# EAGLE design TS-ARM3.0_6 (EAGLE 7.4.0)
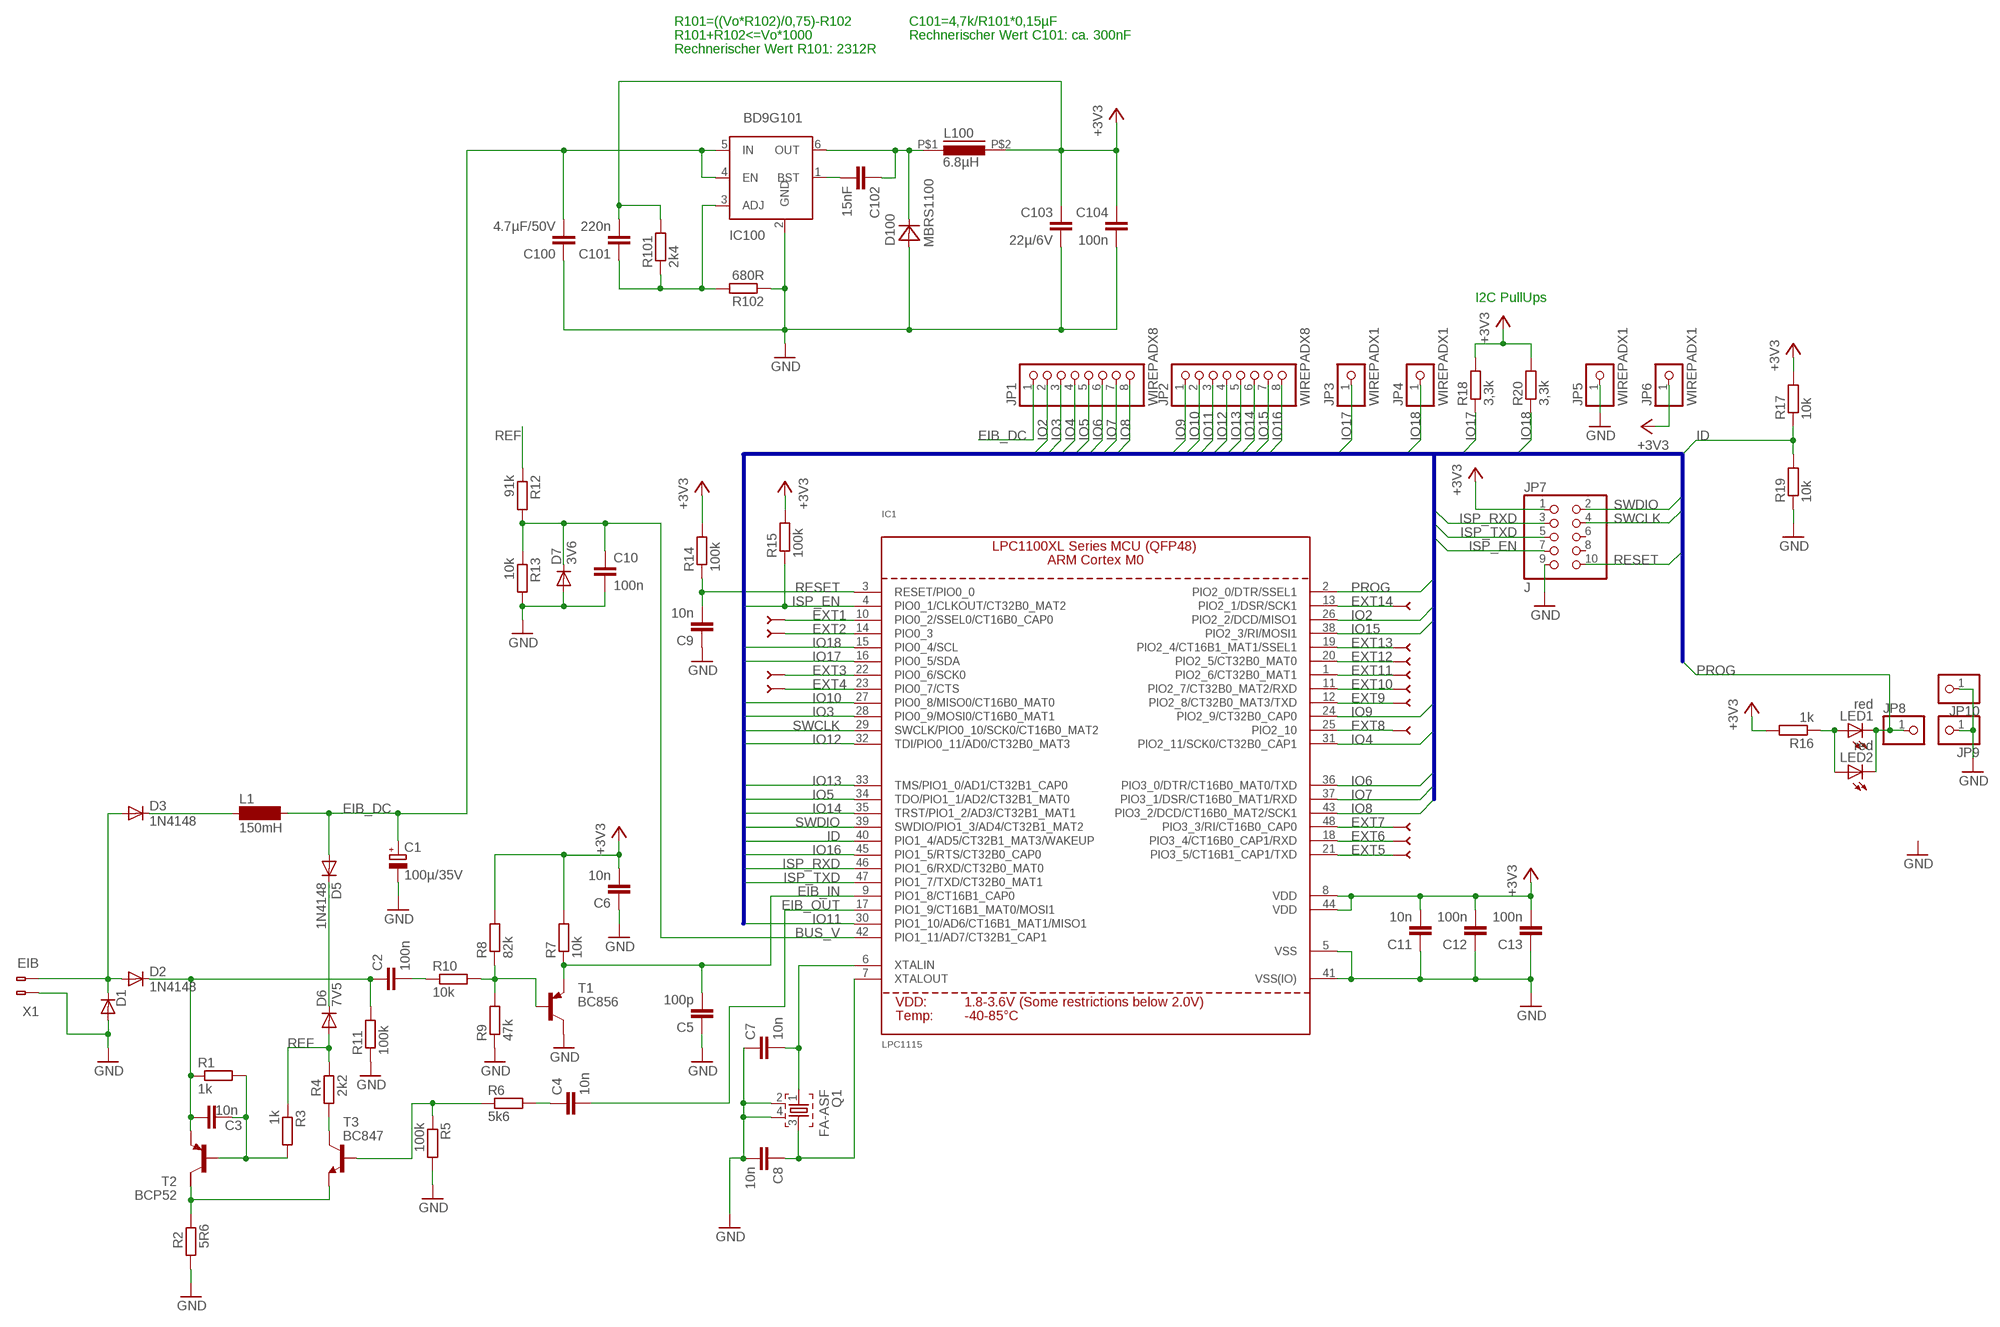
[diagram p0: schematic, sheet 1]

## Parts
C1  100µ/35V  CPOL-EUSANYO_SMD_C6  [SANYO-OSCON_SMD_C6]
C2  100n  C-EUC1206  [C1206]
C3  10n  C-EUC1206  [C1206]
C4  10n  C-EUC1206  [C1206]
C5  100p  C-EUC1206  [C1206]
C6  10n  C-EUC1206  [C1206]
C7  10n  C-EUC1206  [C1206]
C8  10n  C-EUC1206  [C1206]
C9  10n  C-EUC1206  [C1206]
C10  100n  C-EUC1206  [C1206]
C11  10n  C-EUC1206  [C1206]
C12  100n  C-EUC1206  [C1206]
C13  100n  C-EUC1206  [C1206]
C100  4.7µF/50V  C-EUC1206  [C1206]
C101  220n  C-EUC1206  [C1206]
C102  15nF  C-EUC1206  [C1206]
C103  22µ/6V  C-EUC1206  [C1206]
C104  100n  C-EUC1206  [C1206]
D1  SMAJ40C  D-SMB  [SMB]
D2  1N4148  DIODE-MINIMELF  [MINIMELF]
D3  1N4148  DIODE-MINIMELF  [MINIMELF]
D5  1N4148  DIODE-MINIMELF  [MINIMELF]
D6  7V5  DIODE-MINIMELF  [MINIMELF]
D7  3V6  DIODE-MINIMELF  [MINIMELF]
D100  MBRS1100  MBRA340T3  [SMA]
IC1  LPC1115  LPC1113/4/5_QFP48_XLSERIES  [LQFP48]
IC100  BD9G101  BD9G101GBD9G101G-SOT23-6  [SOT23-6]
JP1  WIREPADX8  [SMD1,27X2,54X8]
JP2  WIREPADX8  [SMD1,27X2,54X8]
JP3  WIREPADX1  [SMD1,27X2,54]
JP4  WIREPADX1  [SMD1,27X2,54]
JP5  WIREPADX1  [SMD1,27X2,54]
JP6  WIREPADX1  [SMD1,27X2,54]
JP7  J  PINHD-2X05_2.00  [2X05M]
JP8  PINHD-1X1  [1X01]
JP9  PINHD-1X1  [1X01]
JP10  PINHD-1X1  [1X01]
L1  150mH  SD12-1000  [SD12_1000]
L100  6.8µH  IND_FASTRON_1616FPS  [PIS2812]
LED1  red  LEDCHIPLED_1206  [CHIPLED_1206]
LED2  red  LED3MM  [LED3MM]
P1  PAD  [PAD]
P2  PAD  [PAD]
P3  PAD  [PAD]
P4  PAD  [PAD]
P5  PAD  [PAD]
P6  PAD  [PAD]
P7  PAD  [PAD]
P8  PAD  [PAD]
P9  PAD  [PAD]
P10  PAD  [PAD]
P11  PAD  [PAD]
P12  PAD  [PAD]
P13  PAD  [PAD]
P14  PAD  [PAD]
Q1  FA-ASF  [ASF]
R1  1k  R-EU_R1206  [R1206]
R2  5R6  R-EU_R1206  [R1206]
R3  1k  R-EU_R1206  [R1206]
R4  2k2  R-EU_R1206  [R1206]
R5  100k  R-EU_R1206  [R1206]
R6  5k6  R-EU_R1206  [R1206]
R7  10k  R-EU_R1206  [R1206]
R8  82k  R-EU_R1206  [R1206]
R9  47k  R-EU_R1206  [R1206]
R10  10k  R-EU_R1206  [R1206]
R11  100k  R-EU_R1206  [R1206]
R12  91k  R-EU_R1206  [R1206]
R13  10k  R-EU_R1206  [R1206]
R14  100k  R-EU_R1206  [R1206]
R15  100k  R-EU_R1206  [R1206]
R16  1k  R-EU_R1206  [R1206]
R17  10k  R-EU_R1206  [R1206]
R18  3,3k  R-EU_R1206  [R1206]
R19  10k  R-EU_R1206  [R1206]
R20  3,3k  R-EU_R1206  [R1206]
R101  2k4  R-EU_R1206  [R1206]
R102  680R  R-EU_R1206  [R1206]
T1  BC856  BC856BSMD  [SOT23-BEC]
T2  BCP52  FZT753SMD  [SOT223]
T3  BC847  [SOT23]
X1  EIB  [BUSKLEMME243-724]

## Nets
+3V3: C6.2 C11.2 C12.2 C13.2 C101.2 C103.1 C104.1 IC1.8(VDD) IC1.44(VDD) JP6.1 JP7.1 L100.P$2 R7.2 R8.2 R14.2 R15.2 R16.2 R17.2 R18.2 R20.2 R101.2
BUS_V: C10.2 D7.C IC1.42(PIO1_11/AD7/CT32B1_CAP1) R12.2 R13.1
DRAIN: C2.1 C3.1 D2.C R1.1 R11.2 T2.3(E)
EIB+: D1.1(C) D2.A D3.A X1.2(B-2)
EIB_DC: C1.+ C100.2 D5.A IC100.4(EN) IC100.5(IN) JP1.1 L1.2
EIB_IN: C5.2 IC1.9(PIO1_8/CT16B1_CAP0) R7.1 T1.E
EIB_OUT: C4.2 IC1.17(PIO1_9/CT16B1_MAT0/MOSI1)
EXT1: IC1.10(PIO0_2/SSEL0/CT16B0_CAP0) P1.1
EXT2: IC1.14(PIO0_3) P2.1
EXT3: IC1.22(PIO0_6/SCK0) P13.1
EXT4: IC1.23(PIO0_7/CTS) P14.1
EXT5: IC1.21(PIO3_5/CT16B1_CAP1/TXD) P12.1
EXT6: IC1.18(PIO3_4/CT16B0_CAP1/RXD) P11.1
EXT7: IC1.48(PIO3_3/RI/CT16B0_CAP0) P10.1
EXT8: IC1.25(PIO2_10) P6.1
EXT9: IC1.12(PIO2_8/CT32B0_MAT3/TXD) P4.1
EXT10: IC1.11(PIO2_7/CT32B0_MAT2/RXD) P5.1
EXT11: IC1.1(PIO2_6/CT32B0_MAT1) P9.1
EXT12: IC1.20(PIO2_5/CT32B0_MAT0) P8.1
EXT13: IC1.19(PIO2_4/CT16B1_MAT1/SSEL1) P7.1
EXT14: IC1.13(PIO2_1/DSR/SCK1) P3.1
GND: C1.- C5.1 C6.1 C7.1 C8.2 C9.1 C10.1 C11.1 C12.1 C13.1 C100.1 C103.2 C104.2 D1.2(A) D7.A D100.A IC1.5(VSS) IC1.41(VSS(IO)) IC100.2(GND) JP5.1 JP7.9 JP9.1 JP10.1 Q1.2 Q1.4 R2.1 R5.2 R9.1 R11.1 R13.2 R19.1 R102.1 T1.C X1.1(B-1)
ID: IC1.40(PIO1_4/AD5/CT32B1_MAT3/WAKEUP) R17.1 R19.2
IO2: IC1.26(PIO2_2/DCD/MISO1) JP1.2
IO3: IC1.28(PIO0_9/MOSI0/CT16B0_MAT1) JP1.3
IO4: IC1.31(PIO2_11/SCK0/CT32B0_CAP1) JP1.4
IO5: IC1.34(TDO/PIO1_1/AD2/CT32B1_MAT0) JP1.5
IO6: IC1.36(PIO3_0/DTR/CT16B0_MAT0/TXD) JP1.6
IO7: IC1.37(PIO3_1/DSR/CT16B0_MAT1/RXD) JP1.7
IO8: IC1.43(PIO3_2/DCD/CT16B0_MAT2/SCK1) JP1.8
IO9: IC1.24(PIO2_9/CT32B0_CAP0) JP2.1
IO10: IC1.27(PIO0_8/MISO0/CT16B0_MAT0) JP2.2
IO11: IC1.30(PIO1_10/AD6/CT16B1_MAT1/MISO1) JP2.3
IO12: IC1.32(TDI/PIO0_11/AD0/CT32B0_MAT3) JP2.4
IO13: IC1.33(TMS/PIO1_0/AD1/CT32B1_CAP0) JP2.5
IO14: IC1.35(TRST/PIO1_2/AD3/CT32B1_MAT1) JP2.6
IO15: IC1.38(PIO2_3/RI/MOSI1) JP2.7
IO16: IC1.45(PIO1_5/RTS/CT32B0_CAP0) JP2.8
IO17: IC1.16(PIO0_5/SDA) JP3.1 R18.1
IO18: IC1.15(PIO0_4/SCL) JP4.1 R20.1
ISP_EN: IC1.4(PIO0_1/CLKOUT/CT32B0_MAT2) JP7.7 R15.1
ISP_RXD: IC1.46(PIO1_6/RXD/CT32B0_MAT0) JP7.3
ISP_TXD: IC1.47(PIO1_7/TXD/CT32B0_MAT1) JP7.5
LX: C102.1 D100.C IC100.6(OUT) L100.P$1
N$1: C2.2 R10.1
N$2: C101.1 IC100.3(ADJ) R101.1 R102.2
N$3: C4.1 R6.2
N$4: C7.2 IC1.6(XTALIN) Q1.1
N$5: C8.1 IC1.7(XTALOUT) Q1.3
N$6: R4.1 T3.3(C)
N$7: R2.2 T2.2(C) T3.2(E)
N$8: D3.C L1.1
N$9: D5.C D6.C
N$12: R5.1 R6.1 T3.1(B)
N$14: R8.1 R9.2 R10.2 T1.B
N$15: C3.2 R1.2 R3.2 T2.1(B)
N$19: C102.2 IC100.1(BST)
N$41: LED1.A LED2.A R16.1
PROG: IC1.2(PIO2_0/DTR/SSEL1) JP8.1 LED1.C LED2.K(C)
REF: D6.A R3.1 R4.2 R12.1
RESET: C9.2 IC1.3(RESET/PIO0_0) JP7.10 R14.1
SWCLK: IC1.29(SWCLK/PIO0_10/SCK0/CT16B0_MAT2) JP7.4
SWDIO: IC1.39(SWDIO/PIO1_3/AD4/CT32B1_MAT2) JP7.2
Unconnected: JP7.6 JP7.8 T2.4(C/)

## Buses
IO[1..18],RESET,SWCLK,SWDIO,ISP_EN,PROG,ID,ISP_TXD,ISP_RXD

## Notes on the sheet
- R101=((Vo*R102)/0,75)-R102 | C101=4,7k/R101*0,15µF
- R101+R102<=Vo*1000 | Rechnerischer Wert C101: ca. 300nF
- Rechnerischer Wert R101: 2312R
- I2C PullUps

## Library data of the parts
C1 = rcl:CPOL-EU: POLARIZED CAPACITOR, European symbol; REICHELT: VF 100/35 K-D8
C2 C10 C12 C13 C104 = rcl:C-EU: CAPACITOR, European symbol; REICHELT: X7R-G0805 100N
C3 C4 C6 C9 C11 = rcl:C-EU: CAPACITOR, European symbol; REICHELT: X7R-G0805 10N
C5 = rcl:C-EU: CAPACITOR, European symbol; REICHELT: NPO-G0805 100P
C7 C8 = rcl:C-EU: CAPACITOR, European symbol
C100 = rcl:C-EU: CAPACITOR, European symbol; REICHELT: X7R-G1206 4,7/50
C101 = rcl:C-EU: CAPACITOR, European symbol; REICHELT: Y5R-G0603 220N
C102 = rcl:C-EU: CAPACITOR, European symbol; REICHELT: X7R-G0805 15N
C103 = rcl:C-EU: CAPACITOR, European symbol; REICHELT: X5R-G0805 22/6
D1 = semicon-smd-ipc:D-: DIODE unfilled
D2 D3 D5 = diode:DIODE-: DIODE; REICHELT: 1N 4148 SMD
D6 = diode:DIODE-: DIODE; REICHELT: SMD ZF 7,5
D7 = diode:DIODE-: DIODE; REICHELT: SMD ZF 3,6
D100 = diode:MBRA340T3: Surface Mount Schottky Power Rectifier Source: http://www.onsemi.com/pub_link/Collateral/MBRA340T3-D.PDF; REICHELT: MBRS 1100 SMD
IC1 = microbuilder:LPC1113/4/5_QFP48_XLSERIES: LPC1113/4/5 ARM Cortex M0 MCU (50MHz) - XL Series (FBD48/3x3) LPC1115FBD48/303: Max Frequency: 50MHz Flash: 64kB SRAM: 8kB ADC: 10-bit
IC100 = Stefan_selfbus:BD9G101G
JP1 JP2 = selfbus:WIREPADX8
JP3-JP6 = selfbus:WIREPADX1
JP7 = pinhead-2:PINHD-2X05: PIN HEADER; REICHELT: MPE 150-3-010
JP8-JP10 = pinhead:PINHD-1X1: PIN HEADER
L1 = inductor-neosid:SD12: INDUCTOR nominal inductance; REICHELT: L-11P 150M
L100 = Stefan_selfbus:IND_FASTRON_1616FPS; REICHELT: L-1616FPS 6,8µ
LED1 LED2 = led:LED: LED OSRAM: - CHIPLED LG R971, LG N971, LY N971, LG Q971, LY Q971, LO R971, LY R971 LH N974, LH R974 LS Q976, LO Q976, LY Q976 LO Q996 - Hyper CHIPLED LW Q18S LB Q993, LB Q99A, LB R99A - SideLED LS A670, LO A670, LY A670, LG A670, LP A670 LB A673, LV A673, LT A673, LW A673 LH A674 LY A675 LS A676, LA A676, LO A676, LY A676, LW A676 LS A679, LY A679, LG A679 - Hyper Micro SIDELED® LS Y876, LA Y876, LO Y876, LY Y876 LT Y87S - SmartLED LW L88C, LW L88S LB L89C, LB L89S, LG L890 LS L89K, LO L89K, LY L89K LS L896, LA L896, LO L896, LY L896 - TOPLED LS T670, LO T670, LY T670, LG T670, LP T670 LSG T670, LSP T670, LSY T670, LOP T670, LYG T670 LG T671, LOG T671, LSG T671 LB T673, LV T673, LT T673, LW T673 LH T674 LS T676, LA T676, LO T676, LY T676, LB T676, LH T676, LSB T676, LW T676 LB T67C, LV T67C, LT T67C, LS T67K, LO T67K, LY T67K, LW E67C LS E67B, LA E67B, LO E67B, LY E67B, LB E67C, LV E67C, LT E67C LW T67C LS T679, LY T679, LG T679 LS T770, LO T770, LY T770, LG T770, LP T770 LB T773, LV T773, LT T773, LW T773 LH T774 LS E675, LA E675, LY E675, LS T675 LS T776, LA T776, LO T776, LY T776, LB T776 LHGB T686 LT T68C, LB T68C - Hyper Mini TOPLED® LB M676 - Mini TOPLED Santana® LG M470 LS M47K, LO M47K, LY M47K Source: http://www.osram.convergy.de - LUMILED® LXK2-PW12-R00, LXK2-PW12-S00, LXK2-PW14-U00, LXK2-PW14-V00 LXK2-PM12-R00, LXK2-PM12-S00, LXK2-PM14-U00 LXK2-PE12-Q00, LXK2-PE12-R00, LXK2-PE12-S00, LXK2-PE14-T00, LXK2-PE14-U00 LXK2-PB12-K00, LXK2-PB12-L00, LXK2-PB12-M00, LXK2-PB14-N00, LXK2-PB14-P00, LXK2-PB14-Q00 LXK2-PR12-L00, LXK2-PR12-M00, LXK2-PR14-Q00, LXK2-PR14-R00 LXK2-PD12-Q00, LXK2-PD12-R00, LXK2-PD12-S00 LXK2-PH12-R00, LXK2-PH12-S00 LXK2-PL12-P00, LXK2-PL12-Q00, LXK2-PL12-R00 Source: www.luxeon.com; REICHELT: SMD-LED 0805 RT
P1-P14 = lpc:PAD
Q1 = crystal:FA-: MHz RANGE CRYSTAL UNIT Source: Epson Toyocom
R1 R3 R16 R17 R19 = rcl:R-EU_: RESISTOR, European symbol; REICHELT: SMD-0805 1,00K
R2 = rcl:R-EU_: RESISTOR, European symbol; REICHELT: SMD-0805 5,60
R4 = rcl:R-EU_: RESISTOR, European symbol; REICHELT: SMD-0805 2,20K
R5 R11 R14 R15 = rcl:R-EU_: RESISTOR, European symbol; REICHELT: SMD-0805 100K
R6 = rcl:R-EU_: RESISTOR, European symbol; REICHELT: SMD-0805 5,60K
R7 R10 R13 = rcl:R-EU_: RESISTOR, European symbol; REICHELT: SMD-0805 10,0K
R8 = rcl:R-EU_: RESISTOR, European symbol; REICHELT: SMD-0805 82,0K
R9 = rcl:R-EU_: RESISTOR, European symbol; REICHELT: SMD-0805 47,0K
R12 = rcl:R-EU_: RESISTOR, European symbol; REICHELT: SMD 1/4W 91K
R18 R20 = rcl:R-EU_: RESISTOR, European symbol; REICHELT: SMD-0805 3,30K
R101 = rcl:R-EU_: RESISTOR, European symbol; REICHELT: SMD 1/4W 2,4K
R102 = rcl:R-EU_: RESISTOR, European symbol; REICHELT: SMD-0805 680
T1 = transistor-pnp:BC856*: PNP Transistror; REICHELT: BC 856B SMD
T2 = transistor-pnp:FZT753SMD: PNP Transistor; REICHELT: BCP 52-16 SMD
T3 = transistor:BC847: NPN TRANSISTOR; REICHELT: BC 847C SMD
X1 = con-wago:EIB

## Board
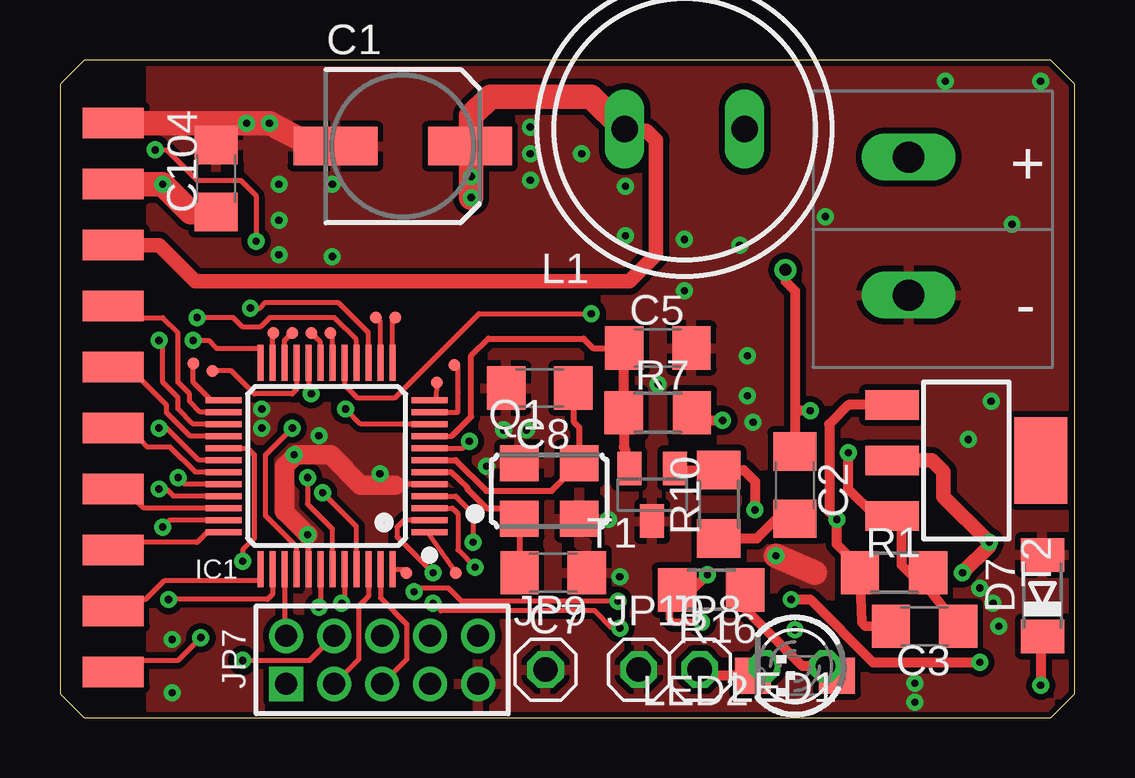
[diagram p1: board, top side]
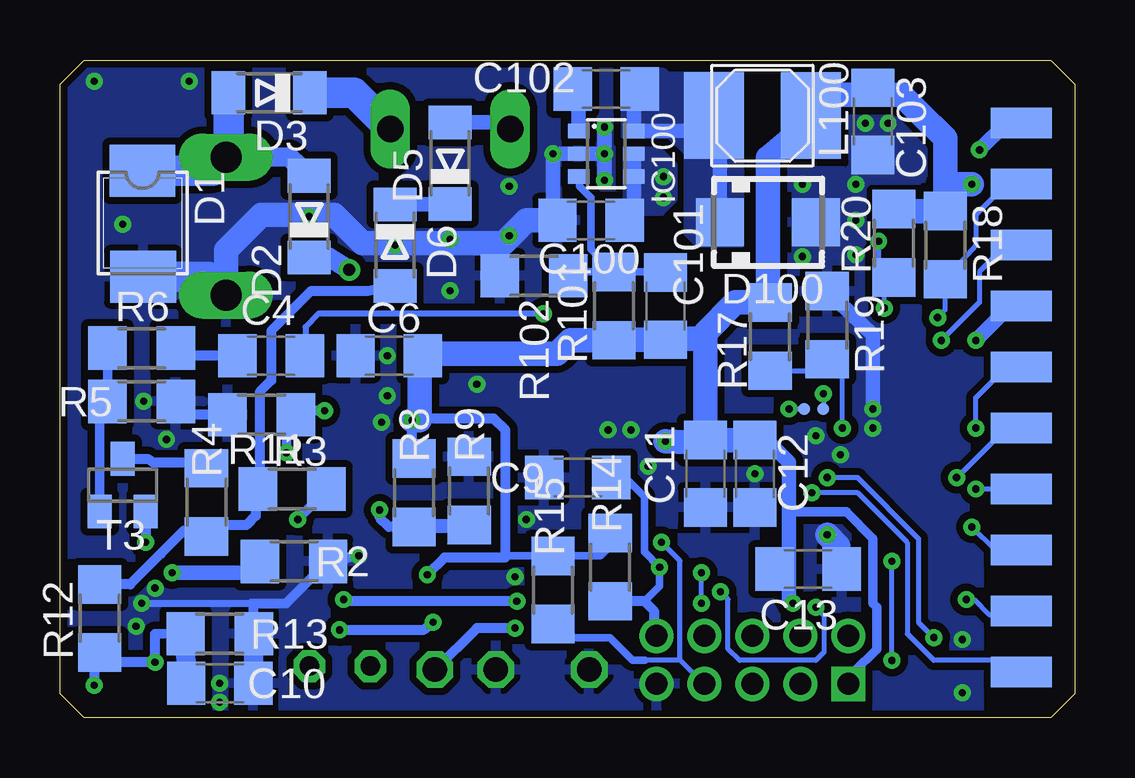
[diagram p2: board, bottom side, seen from below]

Size 42.3 x 27.4 mm. Coordinates in mm from the lower left corner, seen from the top.
Outline: 0,1 1,0 41.3,0 42.3,1 42.3,26.4 41.3,27.4 1,27.4 0,26.4 0,1
Copper layers (1*16): Top 0.035mm / dielectric 1.5mm / Bottom 0.035mm
Design rules "default *": minimum track width 0.2mm, minimum drill 0.3mm, track to track 0.16mm, track to pad 0.16mm, pad to pad 0.16mm, via to via 0.16mm, smd to smd 1mil, copper to edge 0.2mm, drill to drill 8mil, minimum pad ring 10mil, minimum via ring 8mil, stop-mask expansion 4mil, vias tented up to drill 0mil, thermal gap 10mil

### Footprints (pad centres in the part's own frame; a part is rotated, then mirrored left to right if it is on the bottom)
SANYO-OSCON_SMD_C6 = smd 3.5 x 1.6: + 2.8,0; - -2.8,0
C1206 = smd 1.6 x 1.8: 1 -1.4,0; 2 1.4,0
SMB = smd 2.159 x 2.743: 1 -2.311,-0.127; 2 2.108,-0.102
MINIMELF = smd 1.4 x 1.8: A 1.7,0; C -1.7,0
SMA = smd 2 x 2: A 2,0; C -2,0
LQFP48 = smd 1.5 x 0.25: 1 -4.3,2.75; 2 -4.3,2.25; 3 -4.3,1.75; 4 -4.3,1.25; 5 -4.3,0.75; 6 -4.3,0.25; 7 -4.3,-0.25; 8 -4.3,-0.75; 9 -4.3,-1.25; 10 -4.3,-1.75; 11 -4.3,-2.25; 12 -4.3,-2.75; 25 4.3,-2.75; 26 4.3,-2.25; 27 4.3,-1.75; 28 4.3,-1.25; 29 4.3,-0.75; 30 4.3,-0.25; 31 4.3,0.25; 32 4.3,0.75; 33 4.3,1.25; 34 4.3,1.75; 35 4.3,2.25; 36 4.3,2.75 | smd 0.25 x 1.5: 13 -2.75,-4.3; 14 -2.25,-4.3; 15 -1.75,-4.3; 16 -1.25,-4.3; 17 -0.75,-4.3; 18 -0.25,-4.3; 19 0.25,-4.3; 20 0.75,-4.3; 21 1.25,-4.3; 22 1.75,-4.3; 23 2.25,-4.3; 24 2.75,-4.3; 37 2.75,4.3; 38 2.25,4.3; 39 1.75,4.3; 40 1.25,4.3; 41 0.75,4.3; 42 0.25,4.3; 43 -0.25,4.3; 44 -0.75,4.3; 45 -1.25,4.3; 46 -1.75,4.3; 47 -2.25,4.3; 48 -2.75,4.3
SOT23-6 = smd 0.6 x 0.9: 1 -0.95,-1.15; 2 0,-1.15; 3 0.95,-1.15; 4 0.95,1.15; 5 0,1.15; 6 -0.95,1.15
SMD1,27X2,54X8 = smd 2.54 x 1.27: 1 0,8.89; 2 0,6.35; 3 0,3.81; 4 0,1.27; 5 0,-1.27; 6 0,-3.81; 7 0,-6.35; 8 0,-8.89
SMD1,27X2,54 = smd 2.54 x 1.27: 1 0,0
2X05M = drill 0.914 square: 1 -4,-1 | drill 0.914: 2 -4,1; 3 -2,-1; 4 -2,1; 5 0,-1; 6 0,1; 7 2,-1; 8 2,1; 9 4,-1; 10 4,1
1X01 = drill 1.016 octagon: 1 0,0
SD12_1000 = drill 1.1 long: 1 -2.5,0; 2 2.5,0
PIS2812 = smd 3.6 x 2.5: P$1 0,2.025; P$2 0,-2.025
CHIPLED_1206 = smd 1.5 x 1.5: A 0,-1.75; C 0,1.75
LED3MM = drill 0.813 octagon: A -1.27,0; K 1.27,0
PAD = smd 0.5 x 0.5: 1 0,0
ASF = smd 1.6 x 1.5: 1 -1.25,-1.15; 2 1.25,-1.15; 3 1.25,1.15; 4 -1.25,1.15
R1206 = smd 1.6 x 1.803: 1 -1.422,0; 2 1.422,0
SOT23-BEC = smd 1 x 1.4: B -0.95,-1.1; C 0,1.1; E 0.95,-1.1
SOT223 = smd 1.219 x 2.235: 1 -2.311,-3.099; 2 0,-3.099; 3 2.311,-3.099 | smd 3.6 x 2.2: 4 0,3.099
SOT23 = smd 1 x 1.4: 1 -0.95,-1.1; 2 0.95,-1.1; 3 0,1.1
BUSKLEMME243-724 = drill 1.3 long: 1 -2.875,0; 2 2.875,0

### Placement (x,y rotation side)
C1  14.29,23.81 0 top
C2  30.64,9.68 270 top
C3  36.04,3.81 180 top
C4  33.5,15.08 0 bottom
C5  24.92,15.4 180 top
C6  28.57,15.08 0 bottom
C7  20.56,6.03 180 top
C8  20,13.73 180 top
C9  20.72,10 0 bottom
C10  35.64,1.43 180 bottom
C11  15.4,10.16 90 bottom
C12  13.34,10.16 90 bottom
C13  11.11,6.19 180 bottom
C100  20.16,20.72 0 bottom
C101  17.07,17.14 270 bottom
C102  19.53,26.19 180 bottom
C103  8.41,24.84 270 bottom
C104  6.51,22.46 90 top
D1  38.73,20.48 270 bottom
D2  31.91,20.88 90 bottom
D3  33.58,26.04 180 bottom
D5  26.04,23.1 90 bottom
D6  28.34,19.68 270 bottom
D7  40.96,5.08 90 top
D100  12.78,20.64 0 bottom
IC1  11.11,10.48 180 top
IC100  19.53,23.5 270 bottom
JP1  2.22,10.79 0 top
JP2  2.22,10.79 0 bottom
JP3  2.22,22.23 0 bottom
JP4  2.22,24.77 0 bottom
JP5  2.22,24.77 0 top
JP6  2.22,22.23 0 top
JP7  13.43,2.4 0 top
JP8  26.67,2 0 top
JP9  20.24,2 0 top
JP10  24.13,2 0 top
L1  26.04,24.53 180 top
L100  13.02,25.08 90 bottom
LED1  30.64,1.75 90 top
LED2  30.64,2.14 180 top
P1  11.27,12.86 0 bottom
P2  13.18,16.67 0 top
P3  13.97,16.67 0 top
P4  15.72,13.97 0 top
P5  16.43,14.68 0 top
P6  5.56,14.76 0 top
P7  10.48,16.03 0 top
P8  10.48,12.86 0 bottom
P9  16.51,6.03 0 top
P10  14.45,6.03 0 top
P11  11.27,16.03 0 top
P12  6.35,14.45 0 top
P13  9.68,16.03 0 top
P14  8.89,16.03 0 top
Q1  20.4,9.45 0 top
R1  34.77,6.03 180 top
R2  32.54,6.51 180 bottom
R3  32.62,9.53 0 bottom
R4  36.2,8.97 270 bottom
R5  38.89,13.18 0 bottom
R6  38.89,15.4 0 bottom
R7  24.92,12.7 0 top
R8  27.54,9.37 90 bottom
R9  25.24,9.45 270 bottom
R10  27.46,8.89 90 top
R11  33.89,12.62 0 bottom
R12  40.64,4.13 270 bottom
R13  35.64,3.49 0 bottom
R14  19.37,6.27 90 bottom
R15  21.75,5.32 90 bottom
R16  27.15,5.32 180 top
R17  12.7,15.88 90 bottom
R18  5.4,19.68 90 bottom
R19  10.32,16.35 270 bottom
R20  7.54,19.76 90 bottom
R101  19.21,17.14 270 bottom
R102  22.54,18.41 0 bottom
T1  24.69,9.29 180 top
T2  37.78,10.72 270 top
T3  39.69,9.68 0 bottom
X1  35.38,20.48 90 top

### Tracks (layer width: path | path; a pad name or v marks a point on that pad's centre or on a via)
+3V3  (via drill 0.3, 0.3 pad 0.25)
  Top 0.2: IC1.8 16.78,11.23 v17.07,11.51 | IC1.44 11.86,4.88 v11.75,4.76
  Top 0.254: 26.43,12.38 R7.2
  Top 0.305: v26.75,3.97 25.56,3.97 25.4,4.13 25.4,5.31 R16.2
  Top 0.406: 26.43,12.38 v27.62,12.38 | 25.49,5.23 R16.2 26.35,5.32 v26.99,5.95
  Top 1.016: JP6.1 v4.29,22.23 5.45,21.06 C104.1
  Bottom 0.2: C103.1 7.22,25.96 | 11.91,6.18 11.91,6.19 11.75,6.19 v11.75,4.76 | 12.53,6.44 12.51,6.68 C13.2
  Bottom 0.305: 23.73,6.75 R15.2 19.76,6.75 19.37,7.14 R14.2
  Bottom 0.4: 11.91,8.57 9.53,8.57 8.41,7.46 8.41,4.76 8.26,4.6 8.26,2.86 9.21,1.91 9.21,1.63 JP7.1
  Bottom 0.406: 26.67,3.97 v26.75,3.97 27.15,3.65 v30.64,3.65 | C6.2 27.18,14.26 27.3,14.13 | R8.2 27.62,10.95 v27.62,12.38 27.54,12.46 24.21,12.46 23.73,11.99 23.73,6.75 23.73,6.67 26.27,6.67 v26.99,5.95
  Bottom 0.61: C12.2 12.83,11.56 11.91,10.64 11.91,8.57 11.91,6.43 | 11.91,6.43 11.91,6.19 11.91,4.92 v11.75,4.76 | 12.53,6.44 11.91,6.43 | 12.69,17.38 R17.2
  Bottom 1.016: C11.2 C12.2 | v17.07,11.51 15.27,11.43 | 27.3,14.92 27.3,14.13 27.3,12.38 v27.62,12.38 | 15.13,11.72 15.24,11.72 C11.2 | 15.24,11.43 15.27,11.43 | 15.27,11.43 C11.2 | R20.2 7.86,21.27 7.86,21.11 R18.2 5.4,22.23 | 5.4,22.23 v4.29,22.23 | 5.4,22.23 5.4,24.13 6.51,25.24 7.22,25.96 11.27,25.96 11.31,25.2 L100.P$2 11.31,24.57 12.78,23.34 12.78,17.46 | 12.78,17.3 12.78,17.46 | C6.2 27.1,15.16 21.59,15.16 21.03,15.72 R101.2 19.19,15.74 C101.2 17.02,15.8 15.56,15.8 15.4,15.64 | 12.78,17.46 12.7,17.38 R17.2 14.14,17.3 15.4,16.03 15.4,15.64 | 15.08,11.72 15.13,11.72 | 15.13,11.72 15.4,11.99 15.4,15.64
BUS_V  (via drill 0.3)
  Top 0.2: IC1.42 10.86,4.67 v10.79,4.6 | v23.26,4.84 16.75,4.84 16.19,5.4 14.92,5.4 v14.76,5.24 | 40.75,3.17 D7.C 40.84,3.49
  Top 0.406: v30.48,4.92 31.27,4.92 33.89,2.3 v38.34,2.3 | 40.75,3.17 40.88,3.17 v40.88,1.35
  Bottom 0.2: v14.76,5.24 14.45,4.92 14.45,2.86 13.97,2.38 10.79,2.38 10.45,2.73 10.45,4.25 v10.79,4.59 v10.79,4.6
  Bottom 0.4: R13.1 38.34,3.49
  Bottom 0.406: v23.26,4.84 30.4,4.84 v30.48,4.92 | 38.34,3.49 v38.34,2.3 39.93,2.3 40.24,2.62 R12.2 40.88,2.71 v40.88,1.35
  Bottom 0.813: R13.1 C10.2
DRAIN  (via drill 0.3, 0.5)
  Top 0.4: C3.1 36.19,5.4 R1.1
  Top 0.406: 36.19,5.4 36.04,5.4 35.08,6.35 35.08,8 T2.3 33.98,8.4 32.86,9.53 v32.86,11.03 | v30.24,18.65 30.24,18.18 30.64,17.78 30.64,12.78 | 30.64,12.78 C2.1 | v31.27,12.78 30.64,12.78
  Bottom 0.4: R11.2 32.86,12.06 v32.86,11.03
  Bottom 0.406: v31.27,12.78 32.31,12.78 R11.2
  Bottom 0.813: D2.C 31.08,19.18 v30.24,18.65
EIB+
  Bottom 0.813: D2.A 32.74,23.37 X1.2
  Bottom 1.27: D1.1 35.94,22.79 X1.2 35.28,23.46 D3.A
EIB_DC  (via drill 0.3)
  Top 0.254: 23.57,24.49 L1.2
  Top 0.61: JP1.1 4.13,19.68 5.64,18.18 23.73,18.18 24.84,19.29 24.84,24.05 24.45,24.45 23.57,24.49
  Top 1.016: L1.2 23.5,24.53 22.15,25.88 17.94,25.88 17.14,25.08 17.14,23.87 | 17.14,23.87 C1.+ | 17.14,23.87 v17.14,22.54 v17.14,21.67
  Bottom 0.61: IC100.4 | D5.A 23.89,24.8 L1.2 | IC100.4 18.38,21.05 C100.2 | IC100.4 IC100.5
  pour Bottom (no thermals): 16.67,23.02 17.3,23.65 18.65,23.65 18.73,23.65 18.73,21.03 17.22,21.03 16.67,21.59
EIB_IN
  Top 0.2: IC1.9 16.33,11.73 | 23.5,13.89 23.5,14.84 | 23.5,14.84 23.5,15.37 C5.2 | 23.5,14.84
  Top 0.254: 16.33,11.73 17.14,12.54 17.14,15.08 17.86,15.8 21.83,15.8 22.23,15.4 C5.2
  Top 0.406: 23.5,14.84 R7.1 23.5,11.28 T1.E
EIB_OUT  (via drill 0.3)
  Top 0.2: IC1.17 11.86,13.86 12.38,13.34 13.97,13.34 17.46,16.83 v22.15,16.83
  Bottom 0.2: 22.3,16.83 v22.15,16.83
  Bottom 0.254: 22.3,16.83 31.51,16.83 32.07,16.27 32.07,15.48
  Bottom 0.406: 32.07,15.48 32.07,15.11 C4.2
EXT1  (via drill 0.3)
  Top 0.2: IC1.10 12.54,12.23 v11.91,12.86
  Bottom 0.2: v11.91,12.86 P1.1
EXT2
  Top 0.2: IC1.14 13.36,16.48 P2.1
EXT3
  Top 0.2: IC1.22 9.36,15.71 P13.1
EXT4
  Top 0.2: IC1.23 8.86,16.01 P14.1
EXT5
  Top 0.2: IC1.21 9.86,13.67 9.68,13.49 8.1,13.49 7.14,14.45 P12.1
EXT6
  Top 0.2: IC1.18 11.36,15.94 P11.1
EXT7
  Top 0.2: IC1.48 14.3,6.18 P10.1
EXT8
  Top 0.2: IC1.25 6.3,13.23 5.56,13.97 P6.1
EXT9
  Top 0.2: IC1.12 15.69,13.23 P4.1
EXT10
  Top 0.2: IC1.11 16.59,12.73 16.59,13.49 16.59,13.57 16.59,14.68 P5.1
EXT11
  Top 0.2: IC1.1 15.41,7.61 P9.1
EXT12  (via drill 0.3)
  Top 0.2: IC1.20 10.36,13.61 v10.48,13.49
  Bottom 0.2: v10.48,13.49 P8.1
EXT13
  Top 0.2: IC1.19 10.86,15.65 P7.1
EXT14
  Top 0.2: IC1.13 13.86,16.56 P3.1
GND  (via drill 0.3)
  Top 0.2: 15.4,9.73 14.17,9.73 13.97,9.68 | IC1.41 10.36,7.58 v10.32,7.62
  Top 0.254: IC1.5 15.4,9.73
  Top 0.813: 13.97,9.68 12.54,9.68 11.27,10.95 9.84,10.95 9.37,10.48 9.37,8.57 v10.32,7.62
  Top 1.016: 12.54,23.81 C1.- | C1.- 11.59,23.81 11.75,23.65 | C1.- 10.32,23.81 | 6.75,24.77 JP5.1 | v29.84,6.75 31.47,6.03 | JP7.9 17.46,1.43 | 6.75,24.77 v8.73,24.77 11.17,23.5 C1.- | C104.2 6.51,24.53 6.75,24.77
  Bottom 0.3: v38.89,4.76 34.29,4.76
  Bottom 0.406: 34.29,4.76 33.5,4.76 | 33.5,4.76 32.87,4.76 R2.1 30.32,6.67 v29.84,6.75 | R13.2 34.22,4.76 33.5,4.76 | R11.1 36.91,12.62 R5.2
  Bottom 0.61: v8.41,12.86 8.41,15.95 R19.1 | 10.32,20.97 D100.A | v19.61,23.5 IC100.2 v21.75,23.5 21.75,20.8 C100.1 | v19.61,23.5 v19.61,24.61 | v19.61,23.5 v19.61,22.38 | R102.1 23.96,19.69 22.94,20.64 22.86,20.72
  Bottom 0.813: R13.2 34.22,1.45
  Bottom 1.016: C12.1 13.34,8.89 | C13.1 9.84,6.19 9.84,7.14 v10.32,7.62 | C6.1 30.16,15.08 | 34.22,1.45 C10.1 | 22.86,20.72 C100.1 | X1.1 35.38,19.47 33.89,20.95 30.88,20.95 29.69,19.76 23.81,19.76 22.94,20.64
  Bottom 1.27: D1.2 36.14,18.37 X1.1
  other vias: 28.34,19.68 23.34,5.87 9.76,10.95 10.79,11.75 8.41,12.06 28.65,15.08 13.34,10.16 37.86,11.59 38.81,13.18 38.34,5.4 7.78,24.77 11.35,22.23 11.35,19.21 9.13,19.29 9.13,22.23 9.13,20.72 23.57,22.15 23.57,20.08 26.04,19.92 26.04,17.78 36.91,26.51 40.88,26.51 39.69,20.56 31.91,20.88 18.49,11.99 19.45,11.99 4.68,3.25 4.68,1.03 35.64,1.43 35.64,0.64 39.13,3.81 24.92,13.89 28.89,12.3 28.65,13.41 17.78,10.48 22.86,8.26
  pour Top (isolate 0.254, rank 2): 3.81,27.94 42.55,27.78 42.55,0.16 3.81,0.32
  pour Bottom (isolate 0.305, rank 2): 3.97,27.62 42.7,27.62 42.7,0.16 3.97,0.16
  pour Bottom (no thermals): 9.29,24.92 7.46,24.92 6.27,23.73 6.27,22.54 6.51,22.3 8.57,22.3 8.81,22.07 8.81,19.76 9.53,19.05 11.43,19.05 11.67,19.29 11.67,22.46 11.35,22.78 9.53,22.78 9.29,23.02
ID  (via drill 0.3)
  Top 0.2: IC1.40 9.86,7.12 8.57,8.41 8.57,10.95 v9.68,12.06
  Bottom 0.2: R17.1 11.75,14.45 10.32,14.45 R19.2 9.68,14.61 v9.68,12.06
IO2
  Top 0.2: IC1.26 5.85,12.73 5.4,13.18 5.4,13.49 4.92,13.97 4.92,16.03 4.29,16.67 3.33,16.67 2.86,17.14 JP1.2
IO3
  Top 0.2: IC1.28 5.42,11.73 4.45,12.7 4.45,13.02 2.86,14.61 JP1.3
IO4
  Top 0.2: JP1.4 2.7,11.59 3.33,11.59 3.65,11.27 4.6,11.27 5.65,10.23 IC1.31
IO5
  Top 0.2: IC1.34 3.5,8.73 2.7,9.53 JP1.5
IO6
  Top 0.2: IC1.36 6.14,7.73 5.71,7.3 2.54,7.3 JP1.6
IO7
  Top 0.2: JP1.7 2.7,4.45 3.17,4.92 3.57,4.92 4.37,5.71 8.26,5.71 8.36,5.82 IC1.37
IO8  (via drill 0.3)
  Top 0.2: JP1.8 2.86,1.91 3.33,2.38 4.92,2.38 v5.87,3.33 | v10.32,10 10.32,8.89 11.36,7.85 IC1.43
  Bottom 0.2: v10.32,10 9.05,10 6.51,7.46 6.51,3.97 v5.87,3.33
IO9  (via drill 0.3)
  Top 0.2: v5.56,15.72 6.19,15.72 6.51,15.4 8.26,15.4 8.36,15.29 IC1.24
  Bottom 0.2: JP2.1 2.86,19.68 3.97,18.57 3.97,17.3 v5.56,15.72
IO10  (via drill 0.3)
  Top 0.2: IC1.27 5.55,12.23 4.92,12.86 4.92,13.34 4.29,13.97 4.29,15.56 v4.13,15.72
  Bottom 0.2: JP2.2 2.7,17.14
  Bottom 0.61: 2.7,17.14 v4.13,15.72
IO11  (via drill 0.3)
  Top 0.2: IC1.30 5.78,10.73 4.45,12.06 v4.13,12.06
  Bottom 0.2: v4.13,12.06 4.13,13.34 2.86,14.61 JP2.3
IO12  (via drill 0.3)
  Top 0.2: IC1.32 5.2,9.73 v4.92,10
  Bottom 0.2: 2.7,12.06 JP2.4 2.86,12.06 v4.92,10
IO13  (via drill 0.3)
  Top 0.2: v4.13,9.53 4.45,9.53 4.74,9.23 IC1.33
  Bottom 0.2: JP2.5 v4.13,9.53
IO14  (via drill 0.3)
  Top 0.2: 4.45,8.1 v4.29,7.94 4.58,8.23 IC1.35
  Bottom 0.2: JP2.6 3.33,6.99 v4.29,7.94
IO15  (via drill 0.3)
  Top 0.2: IC1.38 8.86,5.13 8.65,4.92 v4.52,4.92
  Bottom 0.2: v4.52,4.92 4.21,4.92 3.57,4.29 2.38,4.29 JP2.7
IO16  (via drill 0.3)
  Top 0.2: IC1.45 12.36,7.96 v10.95,9.37
  Bottom 0.2: JP2.8 2.86,1.91 3.33,2.38 5.87,2.38 6.99,3.49 6.99,7.3 9.05,9.37 v10.95,9.37
IO17  (via drill 0.3)
  Top 0.2: IC1.16 12.36,15.74 11.43,16.67 8.73,16.67 8.33,16.27 7.62,16.27 7.22,16.67 v5.71,16.67
  Bottom 0.2: v5.71,16.67 5.4,16.99 R18.1 4.13,19.69 4.13,20.95 2.86,22.23 JP3.1
IO18  (via drill 0.3)
  Top 0.2: IC1.15 12.86,16.03 11.59,17.3 8.57,17.3 8.33,17.07 v7.94,17.07 | v3.97,23.65 4.45,23.65 5.71,22.38 7.54,22.38 8.18,21.75 v8.18,19.84
  Bottom 0.2: JP4.1 2.86,24.77 | v8.18,19.84 8.18,18.73 7.78,18.73 R20.1 7.94,17.7 v7.94,17.07
  Bottom 0.61: 2.86,24.77 v3.97,23.65
ISP_EN  (via drill 0.3)
  Top 0.2: IC1.4 16.49,9.23 17.22,8.49 v17.22,7.3
  Bottom 0.2: JP7.7 15.45,1.4 16.45,2.4 | 16.45,2.4 17.92,2.4 | 16.45,2.4 16.45,6.53 v17.22,7.3
  Bottom 0.305: 17.92,2.4 18.43,2.4 19.37,3.33 21.19,3.33 R15.1
ISP_RXD
  Top 0.2: IC1.46 12.86,5.06 12.45,4.65 12.45,2.42 JP7.3
ISP_TXD
  Top 0.2: IC1.47 13.36,4.99 14.45,3.9 14.45,2.42 JP7.5
LX
  Bottom 0.61: 15.4,24.45 14.78,24.46 D100.C | C102.1 18.38,26.18 IC100.6 15.68,24.45 L100.P$1
  Bottom 1.016: 15.4,24.45 15.4,24.13 15.72,23.81
  pour Bottom (no thermals): 18.81,24.21 18.81,26.99 17.14,26.99 16.99,26.83 13.89,26.83 13.89,19.68 15.72,19.68 16.19,20.16 16.19,23.5 16.91,24.21
N$1
  Top 0.2: 31.11,7.62 C2.2
  Top 0.406: R10.1 29.06,7.47 29.84,8.26 30.61,8.26 C2.2
N$2
  Bottom 0.305: IC100.3 20.64,22.54 20.64,22.15 20.16,21.67 20.16,19.52 19.57,18.93 | 19.57,18.93 R101.1 17.09,18.57 C101.1 | R102.2 21.6,18.49 21.51,18.57 19.92,18.57 19.57,18.93
N$3
  Bottom 0.406: C4.1 37.47,15.08 R6.2
N$4
  Top 0.254: IC1.6 16.1,10.23 16.27,10.24 16.99,9.59 16.99,9.53 17.78,8.73 18.9,8.73 Q1.1 19.15,6.42 C7.2
N$5
  Top 0.254: C8.1 21.43,13.7 21.43,12.3 21.65,12.09 Q1.3 20.5,9.45 17.78,9.45 16.5,10.73 IC1.7
N$6
  Bottom 0.406: T3.3 38.64,10.78 38.42,10.64 36.2,10.64 R4.1
N$7  (via drill 0.3)
  Top 0.406: v37.62,6.03 37.62,6.19 | 38.66,7.38 v38.73,7.3
  Top 0.61: T2.2 36.35,10.72 36.83,10.24 36.83,9.21 v38.73,7.3 38.73,7.14 v37.62,6.03
  Bottom 0.406: T3.2 38.74,7.46 v38.73,7.3
  Bottom 0.61: R2.2 33.97,6.43 33.97,6.03 v37.62,6.03
N$8
  Bottom 1.27: D3.C 30.04,26.04 L1.1
N$9
  Bottom 0.406: 25.57,21.39 D5.C
  Bottom 0.61: D6.C 25.57,21.39
N$12
  Bottom 0.2: 40.64,12.86 R5.1
  Bottom 0.4: R5.1 R6.1 | T3.1 40.64,12.86
N$14  (via drill 0.3)
  Top 0.406: 26.82,10.15 R10.2 | R10.2 28.5,10.31 28.97,9.84 v28.97,8.65 | T1.B 25.8,10.31 R10.2
  Bottom 0.406: R8.1 28.58,7.94 28.97,8.33 v28.97,8.65
  Bottom 0.61: R9.2 R8.1
N$15  (via drill 0.3)
  Top 0.4: C3.2 33.58,3.81 33.42,3.97 R1.2
  Top 0.406: R1.2 33.34,6.26 32.38,7.22 v32.38,8.26 32.07,8.57 32.07,12.22 32.87,13.03 T2.1
  Bottom 0.406: v32.38,8.26 31.11,9.52 R3.2
N$19
  Bottom 0.61: IC100.1 20.68,26.18 C102.2
N$41
  Top 0.406: R16.1 28.57,4.52 30.96,2.14 LED2.A LED1.A
PROG  (via drill 0.3)
  Top 0.2: v15.56,4.76 15.88,4.45 22.3,4.45 23.02,3.73 v23.34,3.73 | IC1.2 14.34,8.23 14.05,7.94 14.05,7.54 v15.56,6.03
  Top 0.406: JP8.1 26.67,1.98 26.91,1.75 LED1.C LED2.K
  Bottom 0.2: v15.56,4.76 v15.56,6.03 15.56,6.11
  Bottom 0.406: v23.34,3.73 24.92,3.73 JP8.1
REF
  Bottom 0.2: R3.1 34.13,9.84
  Bottom 0.406: R12.1 39.37,5.56 38.27,6.66 38.1,6.82 37.94,6.99 37.14,7.79 R4.2 36.2,8.02 34.53,8.02 34.14,8.41 34.14,9.53 R3.1 33.97,9.53 33.97,13.57 33.5,14.05 33.5,16.11 31.83,17.78 29.48,17.78 D6.A
RESET  (via drill 0.3)
  Top 0.2: IC1.3 16.36,8.73 16.59,8.49 16.59,6.99 v17.3,6.27
  Bottom 0.305: 17.94,4.84 17.3,5.48 v17.3,6.27 17.94,6.91 17.94,9.21 18.89,10.16 C9.2
  Bottom 0.4: 17.52,3.49 JP7.10
  Bottom 0.406: 17.52,3.49 17.52,4.43 17.94,4.84 R14.1
SWCLK  (via drill 0.3)
  Top 0.2: IC1.29 7.82,11.23 8.1,10.95 8.1,7.46 7.62,6.99 v7.62,6.51 | JP7.4 10.41,2.38 v7.62,2.38
  Bottom 0.2: v7.62,2.38 v7.62,6.51
SWDIO
  Top 0.2: IC1.39 9.36,3.47 JP7.2

### Text on the board
tPlace: + | -